# EAGLE design satshakit_cnc_20mhz (EAGLE 8.0.1)
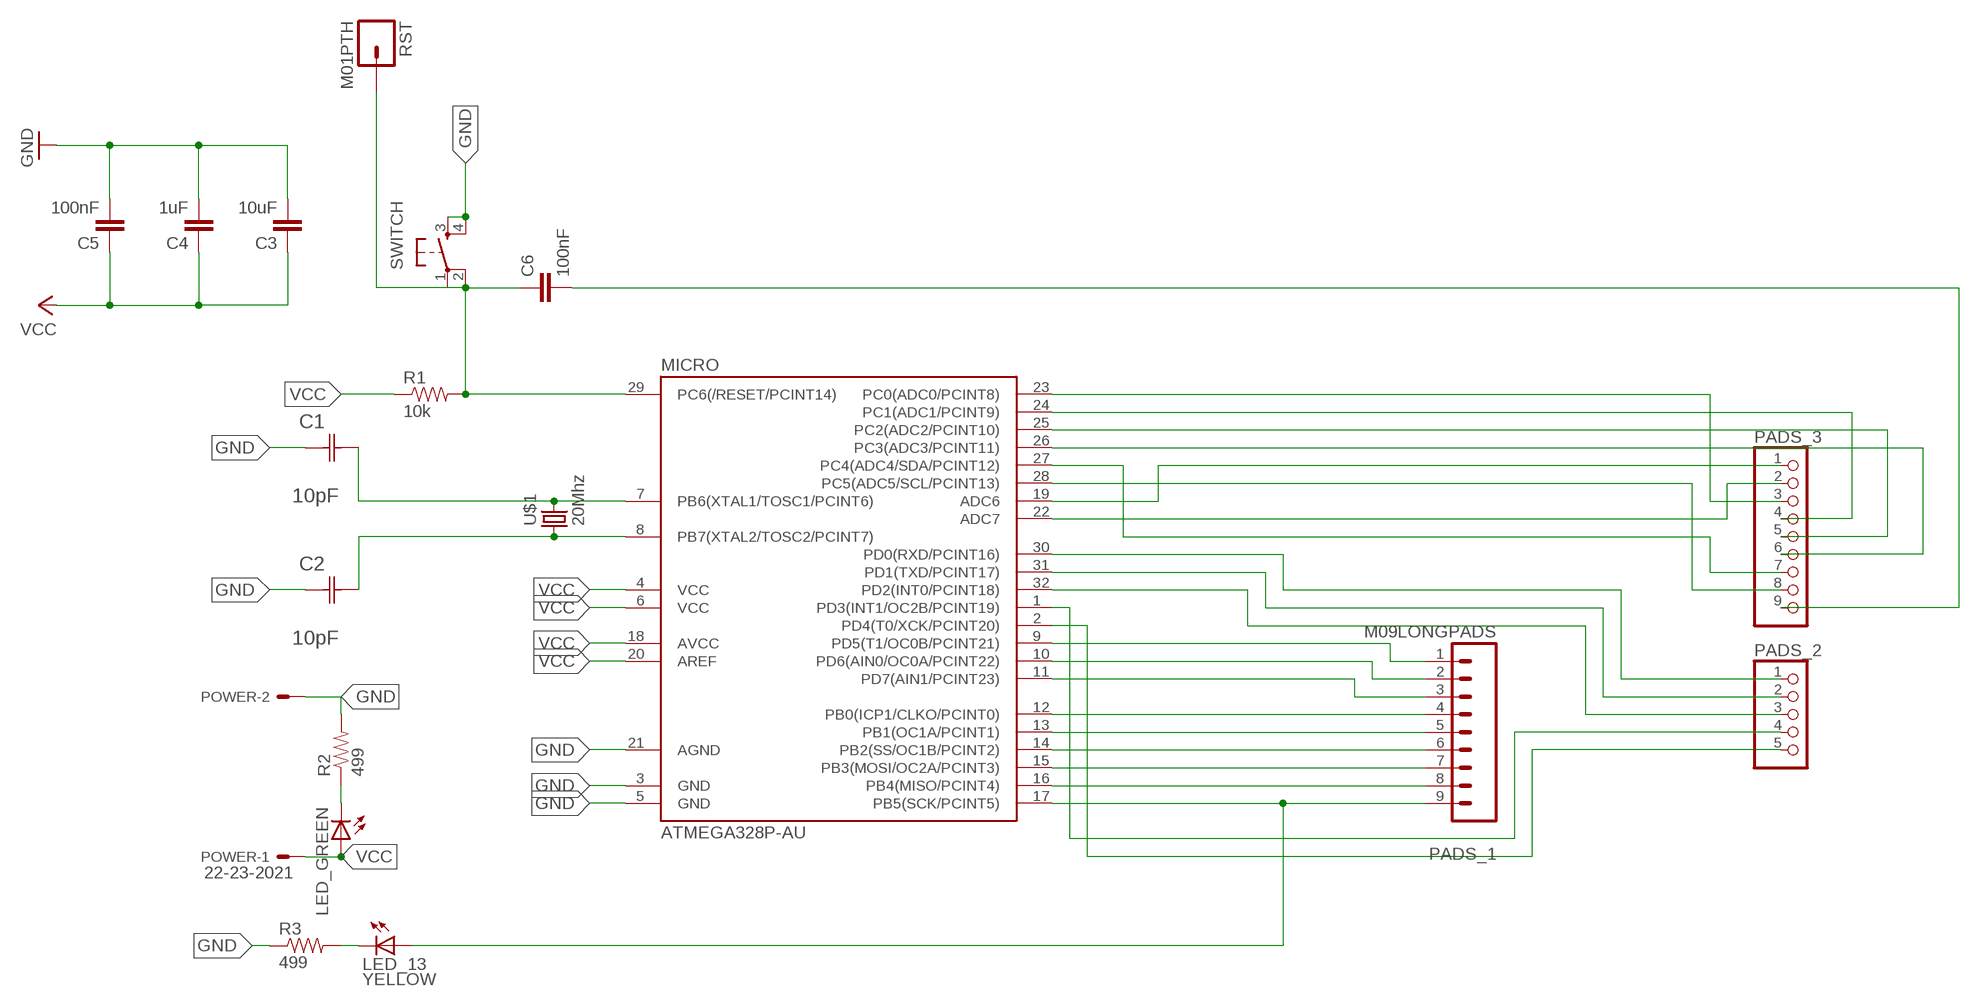
[diagram p0: schematic, sheet 1]

## Parts
C1  10pF  0612ZC225MAT2A  [CAPC3216X178N]
C2  10pF  0612ZC225MAT2A  [CAPC3216X178N]
C3  10uF  CAP1206  [1206]
C4  1uF  CAP1206  [1206]
C5  100nF  CAP1206  [1206]
C6  100nF  CAP1206  [1206]
LED_13  YELLOW  LED1206  [1206]
LED_GREEN  LED1206  [1206]
MICRO  ATMEGA328P-AU  ATMEGA48/88/168-AU  [TQFP32-08]
PADS_1  M09LONGPADS  [1X09_LONGPADS]
PADS_2  PINHD-1X5  [1X05]
PADS_3  PINHD-1X9  [1X09]
POWER  22-23-2021  [22-23-2021]
R1  10k  RESISTOR1206  [1206]
R2  499  RESISTOR1206  [1206]
R3  499  RESISTOR1206  [1206]
RST  M01PTH  [1X01]
SWITCH  6MM_SWITCH6MM_SWITCH  [6MM_SWITCH]
U$1  20Mhz  CRYSTAL  [2-SMD-5X3MM]

## Nets
GND: C1.1(C1) C2.1(C1) C3.2 C4.2 C5.2 MICRO.3(GND) MICRO.5(GND) MICRO.21(AGND) POWER.2 R2.2 R3.1 SWITCH.3(S) SWITCH.4(S1)
N$1: MICRO.9(PD5(T1/OC0B/PCINT21)) PADS_1.1
N$2: C1.2(C2) MICRO.7(PB6(XTAL1/TOSC1/PCINT6)) U$1.P$2
N$3: C6.2 PADS_3.9
N$4: MICRO.10(PD6(AIN0/OC0A/PCINT22)) PADS_1.2
N$5: MICRO.11(PD7(AIN1/PCINT23)) PADS_1.3
N$6: MICRO.12(PB0(ICP1/CLKO/PCINT0)) PADS_1.4
N$7: MICRO.13(PB1(OC1A/PCINT1)) PADS_1.5
N$8: MICRO.14(PB2(SS/OC1B/PCINT2)) PADS_1.6
N$9: C2.2(C2) MICRO.8(PB7(XTAL2/TOSC2/PCINT7)) U$1.P$1
N$10: MICRO.15(PB3(MOSI/OC2A/PCINT3)) PADS_1.7
N$11: MICRO.16(PB4(MISO/PCINT4)) PADS_1.8
N$12: LED_13.1(A) MICRO.17(PB5(SCK/PCINT5)) PADS_1.9
N$13: MICRO.19(ADC6) PADS_3.1
N$14: MICRO.22(ADC7) PADS_3.2
N$15: MICRO.23(PC0(ADC0/PCINT8)) PADS_3.3
N$16: MICRO.24(PC1(ADC1/PCINT9)) PADS_3.4
N$17: MICRO.25(PC2(ADC2/PCINT10)) PADS_3.5
N$18: MICRO.26(PC3(ADC3/PCINT11)) PADS_3.6
N$19: MICRO.27(PC4(ADC4/SDA/PCINT12)) PADS_3.7
N$20: MICRO.30(PD0(RXD/PCINT16)) PADS_2.1
N$21: MICRO.31(PD1(TXD/PCINT17)) PADS_2.2
N$22: MICRO.32(PD2(INT0/PCINT18)) PADS_2.3
N$23: MICRO.1(PD3(INT1/OC2B/PCINT19)) PADS_2.4
N$24: MICRO.2(PD4(T0/XCK/PCINT20)) PADS_2.5
N$25: MICRO.28(PC5(ADC5/SCL/PCINT13)) PADS_3.8
N$26: LED_GREEN.2(C) R2.1
N$27: LED_13.2(C) R3.2
N$28: C6.1 MICRO.29(PC6(/RESET/PCINT14)) R1.2 RST.1 SWITCH.1(P) SWITCH.2(P1)
VCC: C3.1 C4.1 C5.1 LED_GREEN.1(A) MICRO.4(VCC) MICRO.6(VCC) MICRO.18(AVCC) MICRO.20(AREF) POWER.1 R1.1

## Library data of the parts
C1 C2 = AVX_By_element14_Batch_1:0612ZC225MAT2A: Capacitor 1206; MPN: 0612ZC225MAT2A; OC_FARNELL: -; OC_NEWARK: 12N3209; SUPPLIER: AVX; TOLERANCE: ±20%; VALUE: 2.2µF; VOLTAGERATING: 10V
C3-C6 = 01_SparkFun:CAP: Capacitor Standard 0603 ceramic capacitor, and 0.1" leaded capacitor.
LED_13 LED_GREEN = 01_FAB_Hello:LED
MICRO = atmega8:ATMEGA48/88/168
PADS_1 = 01_SparkFun:M09: Header 9 Standard 9-pin 0.1" header. Use with straight break away headers (SKU : PRT-00116), right angle break away headers (PRT-00553), swiss pins (PRT-00743), machine pins (PRT-00117), and female headers (PRT-00115).
PADS_2 = pinhead:PINHD-1X5: PIN HEADER
PADS_3 = pinhead:PINHD-1X9: PIN HEADER
POWER = con-molex:22-23-2021: .100" (2.54mm) Center Header - 2 Pin; MF: MOLEX; MPN: 22-23-2021; OC_FARNELL: 1462926; OC_NEWARK: 25C3832
R1-R3 = 01_SparkFun:RESISTOR: Resistor Basic schematic elements and footprints for 0603, 1206, and PTH 1/10th watt (small) resistors.
RST = 01_SparkFun:M01: Header 1 Standard 1-pin 0.1" header. Use with straight break away headers (SKU : PRT-00116), right angle break away headers (PRT-00553), swiss pins (PRT-00743), machine pins (PRT-00117), and female headers (PRT-00115).
SWITCH = 01_FAB_Hello:6MM_SWITCH: OMRON SWITCH
U$1 = fab:CRYSTAL

## Board
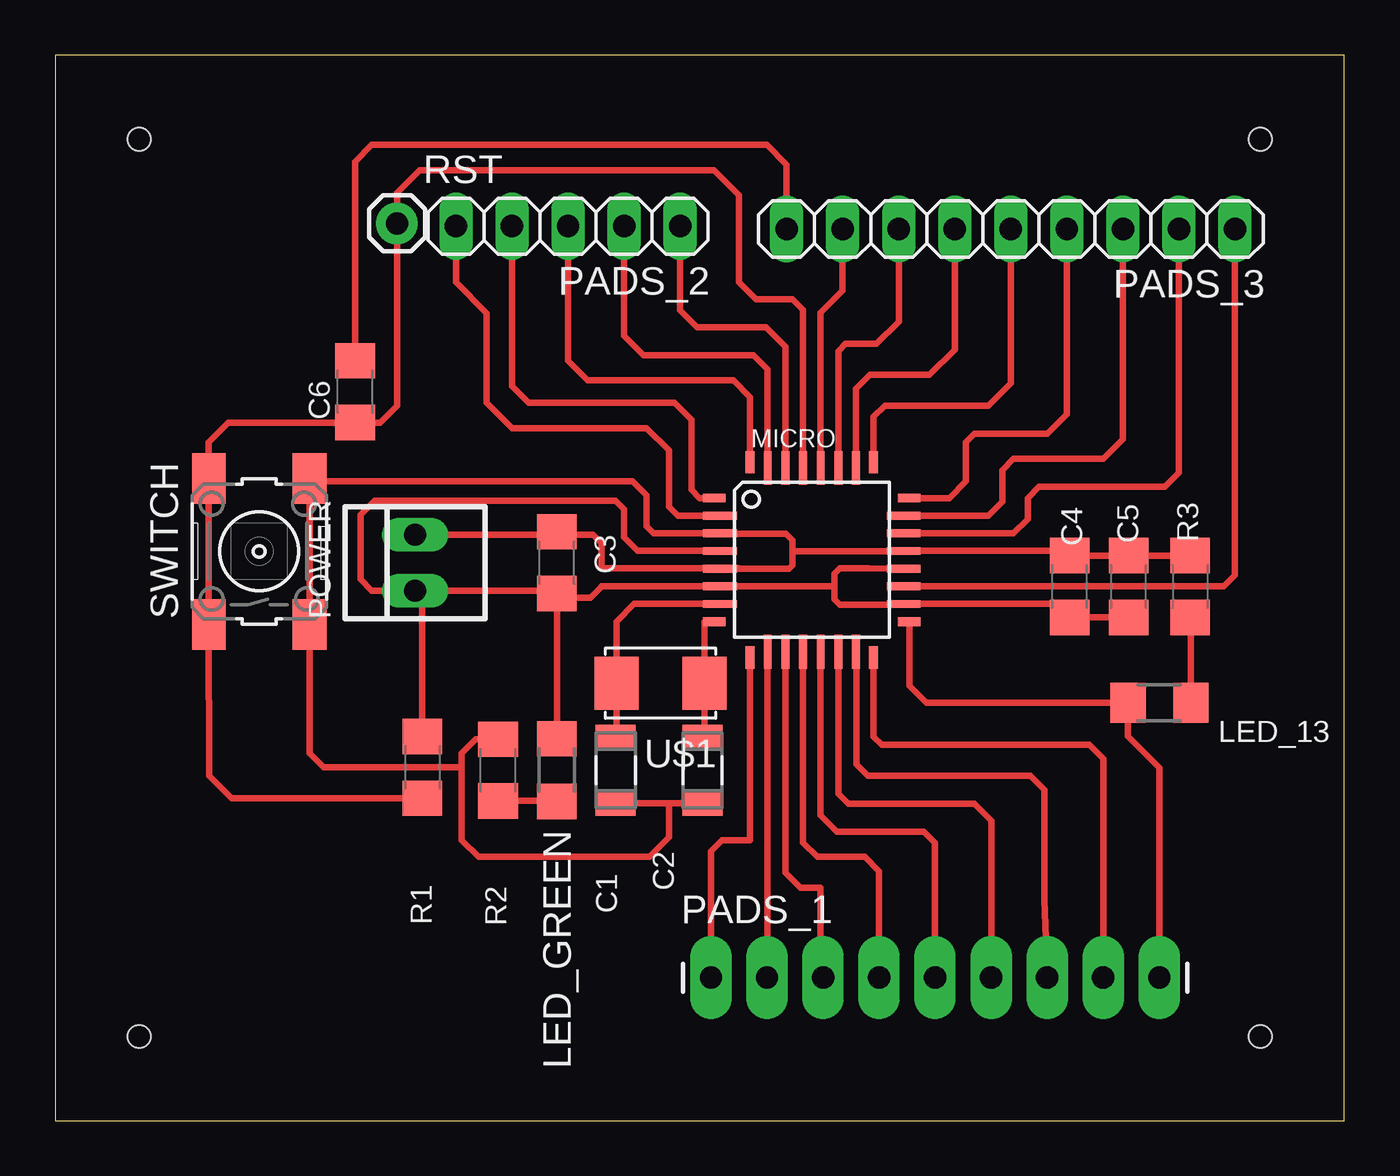
[diagram p1: board, top side]

Size 58.42 x 48.26 mm. Coordinates in mm from the lower left corner, seen from the top.
Outline: 0,0 58.42,0 58.42,48.26 0,48.26 0,0
Copper layers (1*16): Top 0.035mm / dielectric 1.5mm / Bottom 0.035mm
Design rules "default *": minimum track width 12mil, minimum drill 24mil, track to track 16mil, track to pad 16mil, pad to pad 16mil, via to via 16mil, smd to smd 16mil, copper to edge 40mil, drill to drill 8mil, minimum pad ring 10mil, minimum via ring 8mil, stop-mask expansion 4mil, vias tented up to drill 0mil, thermal gap 10mil
Holes 1.02 mm at 3.81,44.45 3.81,3.81 54.61,3.81 54.61,44.45

### Footprints (pad centres in the part's own frame; a part is rotated, then mirrored left to right if it is on the bottom)
CAPC3216X178N = smd 1.118 x 1.803: 1 -1.499,0; 2 1.499,0
1206 = smd 1.6 x 1.8: 1 -1.4,0; 2 1.4,0
1206' = smd 1.6 x 1.803: 1 -1.422,0; 2 1.422,0
TQFP32-08 = smd 1.016 x 0.406: 1 -4.42,2.8; 8 -4.42,-2.8; 17 4.42,-2.8; 24 4.42,2.8 | smd 1.524 x 0.356: 2 -4.166,2; 3 -4.166,1.2; 4 -4.166,0.4; 5 -4.166,-0.4; 6 -4.166,-1.2; 7 -4.166,-2; 18 4.166,-2; 19 4.166,-1.2; 20 4.166,-0.4; 21 4.166,0.4; 22 4.166,1.2; 23 4.166,2 | smd 0.406 x 1.016: 9 -2.8,-4.42; 16 2.8,-4.42; 25 2.8,4.42; 32 -2.8,4.42 | smd 0.356 x 1.524: 10 -2,-4.166; 11 -1.2,-4.166; 12 -0.4,-4.166; 13 0.4,-4.166; 14 1.2,-4.166; 15 2,-4.166; 26 2,4.166; 27 1.2,4.166; 28 0.4,4.166; 29 -0.4,4.166; 30 -1.2,4.166; 31 -2,4.166
1X09_LONGPADS = drill 1.016 pad 1.88 long: 1 0,0; 2 2.54,0; 3 5.08,0; 4 7.62,0; 5 10.16,0; 6 12.7,0; 7 15.24,0; 8 17.78,0; 9 20.32,0
1X05 = drill 1.016 long: 1 -5.08,0; 2 -2.54,0; 3 0,0; 4 2.54,0; 5 5.08,0
1X09 = drill 1.016 long: 1 -10.16,0; 2 -7.62,0; 3 -5.08,0; 4 -2.54,0; 5 0,0; 6 2.54,0; 7 5.08,0; 8 7.62,0; 9 10.16,0
22-23-2021 = drill 1 long: 1 -1.27,0; 2 1.27,0
1X01 = drill 1.016 pad 1.88: 1 0,0
6MM_SWITCH = smd 2.286 x 1.524: 1 -3.302,2.286; 2 3.302,2.286; 3 -3.302,-2.286; 4 3.302,-2.286
2-SMD-5X3MM = smd 2 x 2.4: P$1 -2,0; P$2 2,0

### Placement (x,y rotation side)
C1  25.4,15.88 90 top
C2  29.34,15.88 90 top
C3  22.73,25.27 90 top
C4  45.97,24.19 90 top
C5  48.64,24.19 90 top
C6  13.59,33.02 90 top
LED_13  YELLOW  [1206']  50.04,18.92 0 top
LED_GREEN  [1206']  22.73,15.88 270 top
MICRO  34.29,25.4 0 top
PADS_1  29.72,6.48 0 top
PADS_2  23.24,40.51 180 top
PADS_3  43.31,40.39 180 top
POWER  16.31,25.27 90 top
R1  16.64,16 270 top
R2  20.07,15.88 90 top
R3  51.44,24.19 270 top
RST  15.49,40.64 0 top
SWITCH  9.25,25.78 90 top
U$1  27.43,19.81 180 top

### Tracks (layer width: path | path; a pad name or v marks a point on that pad's centre or on a via)
GND
  Top 0.305: MICRO.5 | MICRO.21 | MICRO.5 30.12,25.02 24.77,25.02 24.77,26.16 24.38,26.54 23.43,26.54 | MICRO.5 30.73,25.02 30.99,25.02 | MICRO.21 38.1,25.79 | 38.1,25.79 37.85,25.78 | 11.56,29.08 SWITCH.4 | 11.56,28.45 11.53,28.45 11.53,28.96 | C1.1 27.81,14.38 | 27.81,14.38 C2.1 | 27.81,14.38 27.81,12.83 26.92,11.94 19.18,11.94 18.41,12.7 18.41,16 | 11.53,28.96 SWITCH.4 | 11.53,28.96 26.16,28.96 26.8,28.32 26.8,26.92 27.12,26.6 MICRO.3 30.15,26.57 33.12,26.57 33.4,26.29 33.4,25.91 | SWITCH.3 11.53,22.61 | SWITCH.4 11.53,22.61 | 16.37,26.48 POWER.2 23.43,26.54 | 23.43,26.54 C3.2 | R2.2 19.05,17.27 18.41,16.64 18.41,16 | MICRO.21 45.72,25.8 C4.2 C5.2 R3.1 | MICRO.5 33.26,25 33.4,25.15 33.4,25.91 | 33.4,25.91 33.52,25.79 38.1,25.79 | 11.53,22.61 11.56,22.58 11.56,21.72 11.53,21.69 11.53,16.64 12.17,16 18.41,16
N$1
  Top 0.305: PADS_1.1 29.72,12.19 30.23,12.7 31.49,12.7 MICRO.9
N$2
  Top 0.305: C1.2 25.43,17.37 U$1.P$2 25.43,22.61 26.23,23.4 MICRO.7
N$3
  Top 0.305: C6.2 13.59,43.43 14.35,44.2 32.26,44.2 33.15,43.31 PADS_3.9
N$4
  Top 0.305: PADS_1.2 32.29,10.03 MICRO.10
N$5
  Top 0.305: PADS_1.3 34.8,7.11 34.67,7.11 34.67,10.54 33.78,10.54 33.09,11.23 MICRO.11
N$6
  Top 0.305: 33.91,21.23 MICRO.12 33.89,12.59 34.54,11.94 36.7,11.94 37.34,11.3 PADS_1.4
N$7
  Top 0.305: PADS_1.5 39.88,12.57 39.37,13.08 35.43,13.08 34.69,13.82 MICRO.13
N$8
  Top 0.305: PADS_1.6 42.42,13.59 41.66,14.35 35.94,14.35 35.49,14.8 MICRO.14
N$9
  Top 0.305: C2.2 29.43,17.37 U$1.P$1 29.43,22.6 MICRO.8
N$10
  Top 0.305: PADS_1.7 44.83,10.03 44.83,14.99 44.2,15.62 36.83,15.62 36.32,16.13 36.32,20.45 MICRO.15
N$11
  Top 0.305: MICRO.16 37.09,17.39 37.47,17.02 46.86,17.02 47.5,16.38 PADS_1.8
N$12
  Top 0.305: MICRO.17 38.71,19.68 39.47,18.92 LED_13.1 48.62,17.4 50.04,15.98 PADS_1.9
N$13
  Top 0.305: MICRO.19 52.96,24.2 53.47,24.71 PADS_3.1
N$14
  Top 0.305: MICRO.22 43.43,26.6 44.07,27.23 44.07,28.19 44.58,28.7 50.29,28.7 50.93,29.34 PADS_3.2
N$15
  Top 0.305: MICRO.23 42.29,27.4 42.93,28.04 42.93,29.46 43.43,29.97 47.5,29.97 48.39,30.86 PADS_3.3
N$16
  Top 0.305: MICRO.24 40.51,28.2 41.27,28.96 41.27,30.73 41.66,31.11 44.96,31.11 45.85,32 PADS_3.4
N$17
  Top 0.305: MICRO.25 37.08,31.88 37.59,32.39 42.29,32.39 43.31,33.4 PADS_3.5
N$18
  Top 0.305: 36.32,29.57 MICRO.26 36.29,33.15 36.93,33.78 39.62,33.78 40.77,34.93 PADS_3.6
N$19
  Top 0.305: PADS_3.7 38.23,36.2 37.21,35.18 35.81,35.18 35.49,34.86 MICRO.27
N$20
  Top 0.305: PADS_2.1 28.32,36.7 29.08,35.94 32.2,35.94 33.09,35.05 MICRO.30
N$21
  Top 0.305: PADS_2.2 25.78,35.56 26.67,34.67 31.66,34.67 32.29,34.04 MICRO.31
N$22
  Top 0.305: MICRO.32 31.5,32.77 30.73,33.53 24.13,33.53 23.24,34.42 PADS_2.3
N$23
  Top 0.305: MICRO.1 29.2,28.2 28.83,28.57 28.83,31.75 28.07,32.51 21.46,32.51 20.7,33.27 PADS_2.4
N$24
  Top 0.305: MICRO.2 28.23,27.4 27.81,27.81 27.81,30.35 26.8,31.37 20.7,31.37 19.56,32.51 19.56,36.58 18.16,37.97 PADS_2.5
N$25
  Top 0.305: 34.67,29.57 MICRO.28 34.69,36.6 35.69,37.59 PADS_3.8
N$26
  Top 0.305: R2.1 22.48,14.48 LED_GREEN.2
N$27
  Top 0.305: R3.2 51.46,22.79 LED_13.2
N$28
  Top 0.305: 33.91,29.57 MICRO.29 33.89,36.72 33.4,37.21 31.75,37.21 30.99,37.97 30.99,41.91 29.84,43.05 16.51,43.05 15.49,42.04 RST.1 15.49,32.38 14.73,31.62 C6.1 7.85,31.62 6.96,30.73 SWITCH.2 | 7.49,29.08 SWITCH.2 | 7.24,29.36 SWITCH.2 | R1.2 8.13,14.61 8,14.61 6.98,15.62 SWITCH.1 SWITCH.2
VCC
  Top 0.305: MICRO.18 | MICRO.20 36.83,25.02 35.56,25.02 35.31,24.77 35.31,24.26 | MICRO.18 38.46,23.37 35.56,23.37 35.31,23.62 35.31,24.26 | MICRO.6 30.81,24.21 | MICRO.6 24.77,24.2 24.77,24.19 24.26,23.68 23.43,23.68 C3.1 | 16.64,24 23.43,24 C3.1 | 16.64,24 POWER.1 14.35,24 13.84,24.51 13.84,27.43 14.48,28.07 25.4,28.07 25.78,27.69 25.78,26.42 26.4,25.8 MICRO.4 | 16.64,24 R1.1 | C3.1 LED_GREEN.1 | 45.72,22.86 C4.1 46.1,22.79 | 46.1,22.79 C5.1 | MICRO.6 35.25,24.2 35.31,24.26 | MICRO.18 45.49,23.4 46.1,22.79